# EAGLE design Card_Pi_HAT (EAGLE 6.4)
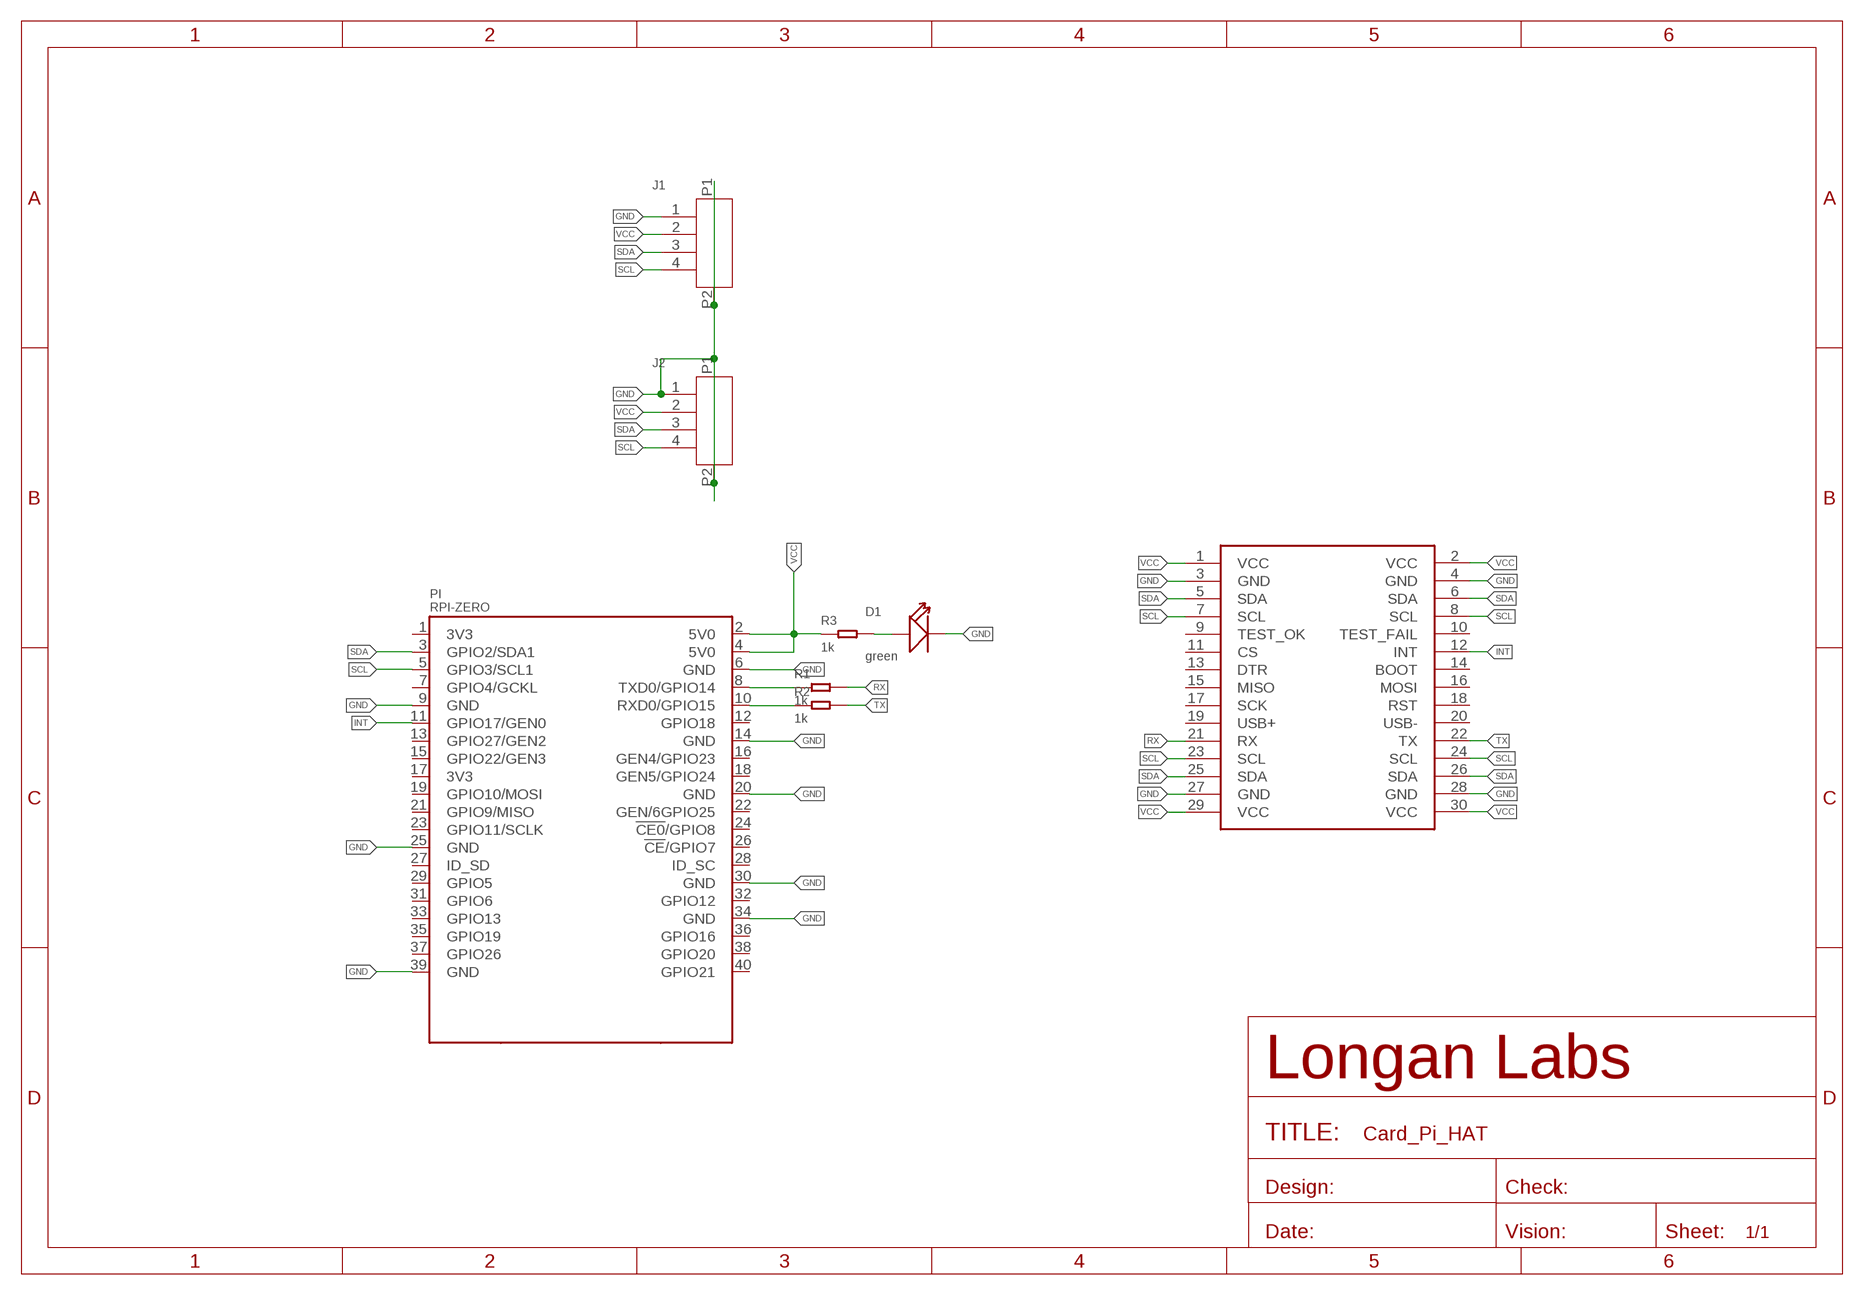
[diagram p0: schematic, sheet 1]

## Parts
D1  green  LED'0603'  [LED-0603]
J1  HEADER-4P-1.0  [4P-1.0-90D]
J2  HEADER-4P-1.0  [4P-1.0-90D]
MOUDLE1  MOUDLE-2X15P-2.54'90D'  [2X15P-2.54-90D]
PI  RPI-ZERO  [RASPBERRYPI_BASTELSTUBE_V13_RASPI_BOARD_B+_FULL]
R1  1k  RES-0603  [R0603]
R2  1k  RES-0603  [R0603]
R3  1k  RES-0603  [R0603]

## Nets
GND: D1.- J1.1 J1.P1 J1.P2 J2.1 J2.P1 J2.P2 MOUDLE1.3(GND) MOUDLE1.4(GND) MOUDLE1.27(GND) MOUDLE1.28(GND) PI.6(GND) PI.9(GND) PI.14(GND) PI.20(GND) PI.25(GND) PI.30(GND) PI.34(GND) PI.39(GND)
INT: MOUDLE1.12(INT) PI.11(GPIO17/GEN0)
N$1: PI.8(TXD0/GPIO14) R1.1
N$2: PI.10(RXD0/GPIO15) R2.1
N$3: D1.+ R3.2
RX: MOUDLE1.21(RX) R1.2
SCL: J1.4 J2.4 MOUDLE1.7(SCL) MOUDLE1.8(SCL) MOUDLE1.23(SCL) MOUDLE1.24(SCL) PI.5(GPIO3/SCL1)
SDA: J1.3 J2.3 MOUDLE1.5(SDA) MOUDLE1.6(SDA) MOUDLE1.25(SDA) MOUDLE1.26(SDA) PI.3(GPIO2/SDA1)
TX: MOUDLE1.22(TX) R2.2
VCC: J1.2 J2.2 MOUDLE1.1(VCC) MOUDLE1.2(VCC) MOUDLE1.29(VCC) MOUDLE1.30(VCC) PI.2(5V0) PI.4(5V0) R3.1
Unconnected: MOUDLE1.9(TEST_OK) MOUDLE1.10(TEST_FAIL) MOUDLE1.11(CS) MOUDLE1.13(DTR) MOUDLE1.14(BOOT) MOUDLE1.15(MISO) MOUDLE1.16(MOSI) MOUDLE1.17(SCK) MOUDLE1.18(RST) MOUDLE1.19(USB+) MOUDLE1.20(USB-) PI.1(3V3) PI.7(GPIO4/GCKL) PI.12(GPIO18) PI.13(GPIO27/GEN2) PI.15(GPIO22/GEN3) PI.16(GEN4/GPIO23) PI.17(3V3) PI.18(GEN5/GPIO24) PI.19(GPIO10/MOSI) PI.21(GPIO9/MISO) PI.22(GEN/6GPIO25) PI.23(GPIO11/SCLK) PI.24(!CE0!/GPIO8) PI.26(!CE!/GPIO7) PI.27(ID_SD) PI.28(ID_SC) PI.29(GPIO5) PI.31(GPIO6) PI.32(GPIO12) PI.33(GPIO13) PI.35(GPIO19) PI.36(GPIO16) PI.37(GPIO26) PI.38(GPIO20) PI.40(GPIO21)

## Library data of the parts
D1 = Discrete-new:LED
J1 J2 = Longan-Connect:HEADER-4P-1.0
MOUDLE1 = Longan-moudle:MOUDLE-2X15P-2.54
PI = RPI-Zero:RPI-ZERO
R1-R3 = Discrete-new:RES

## Board
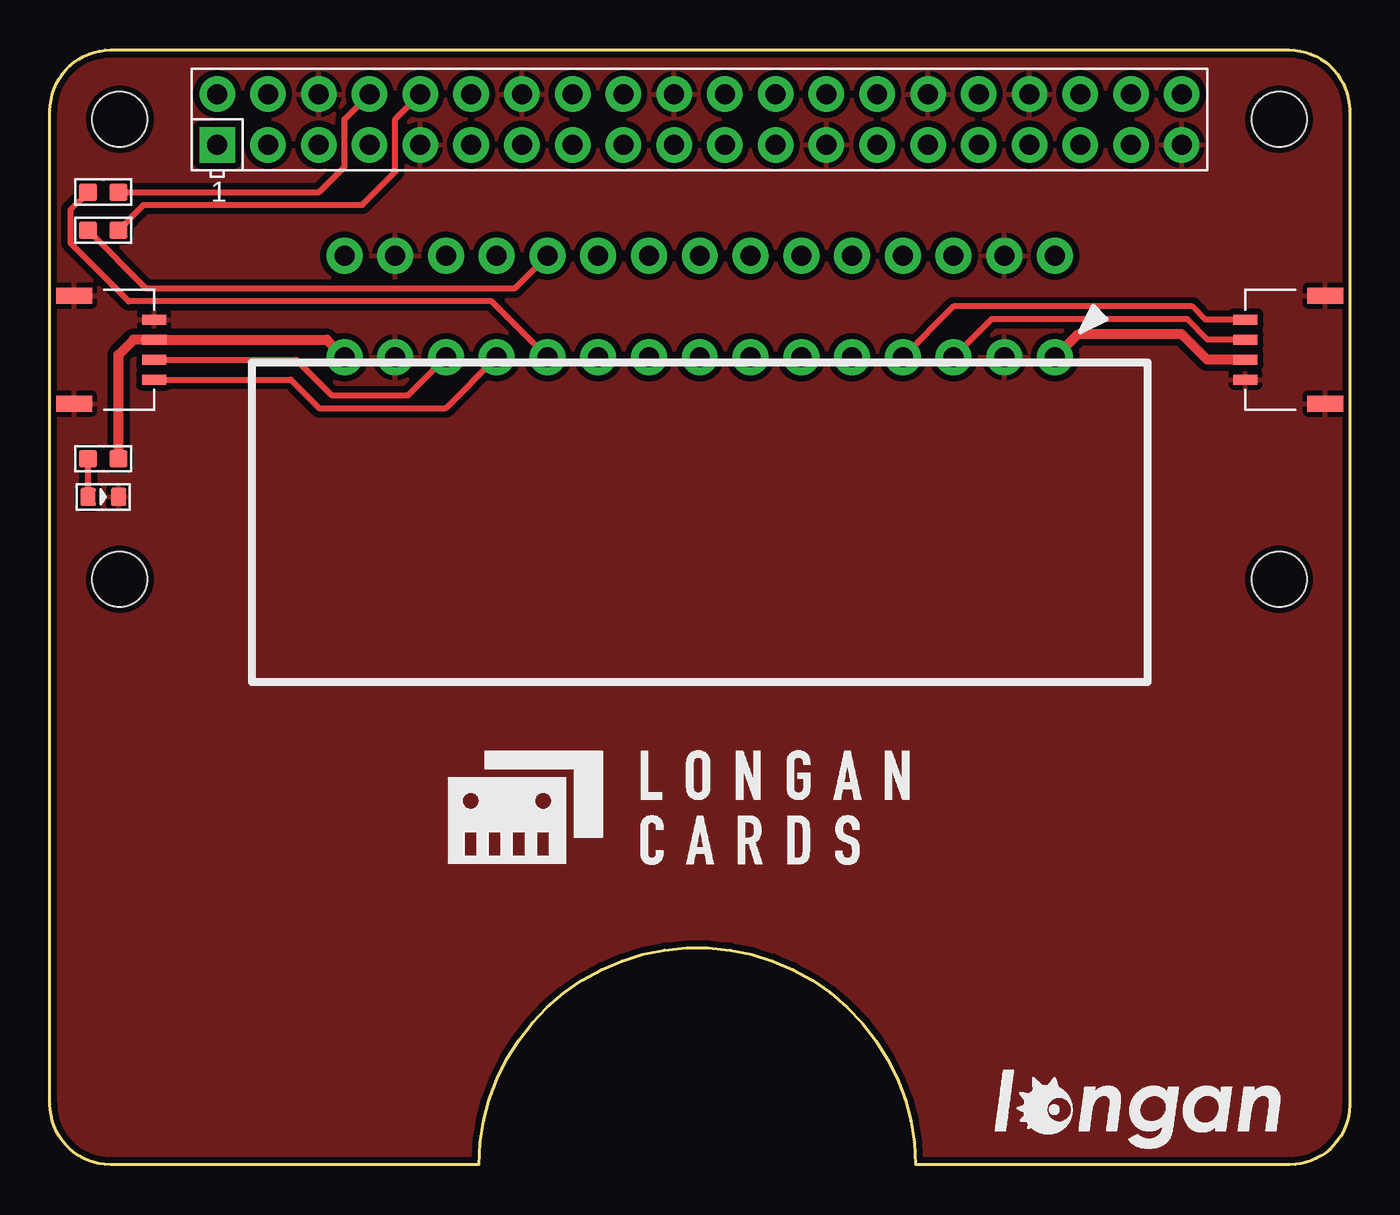
[diagram p1: board, top side]
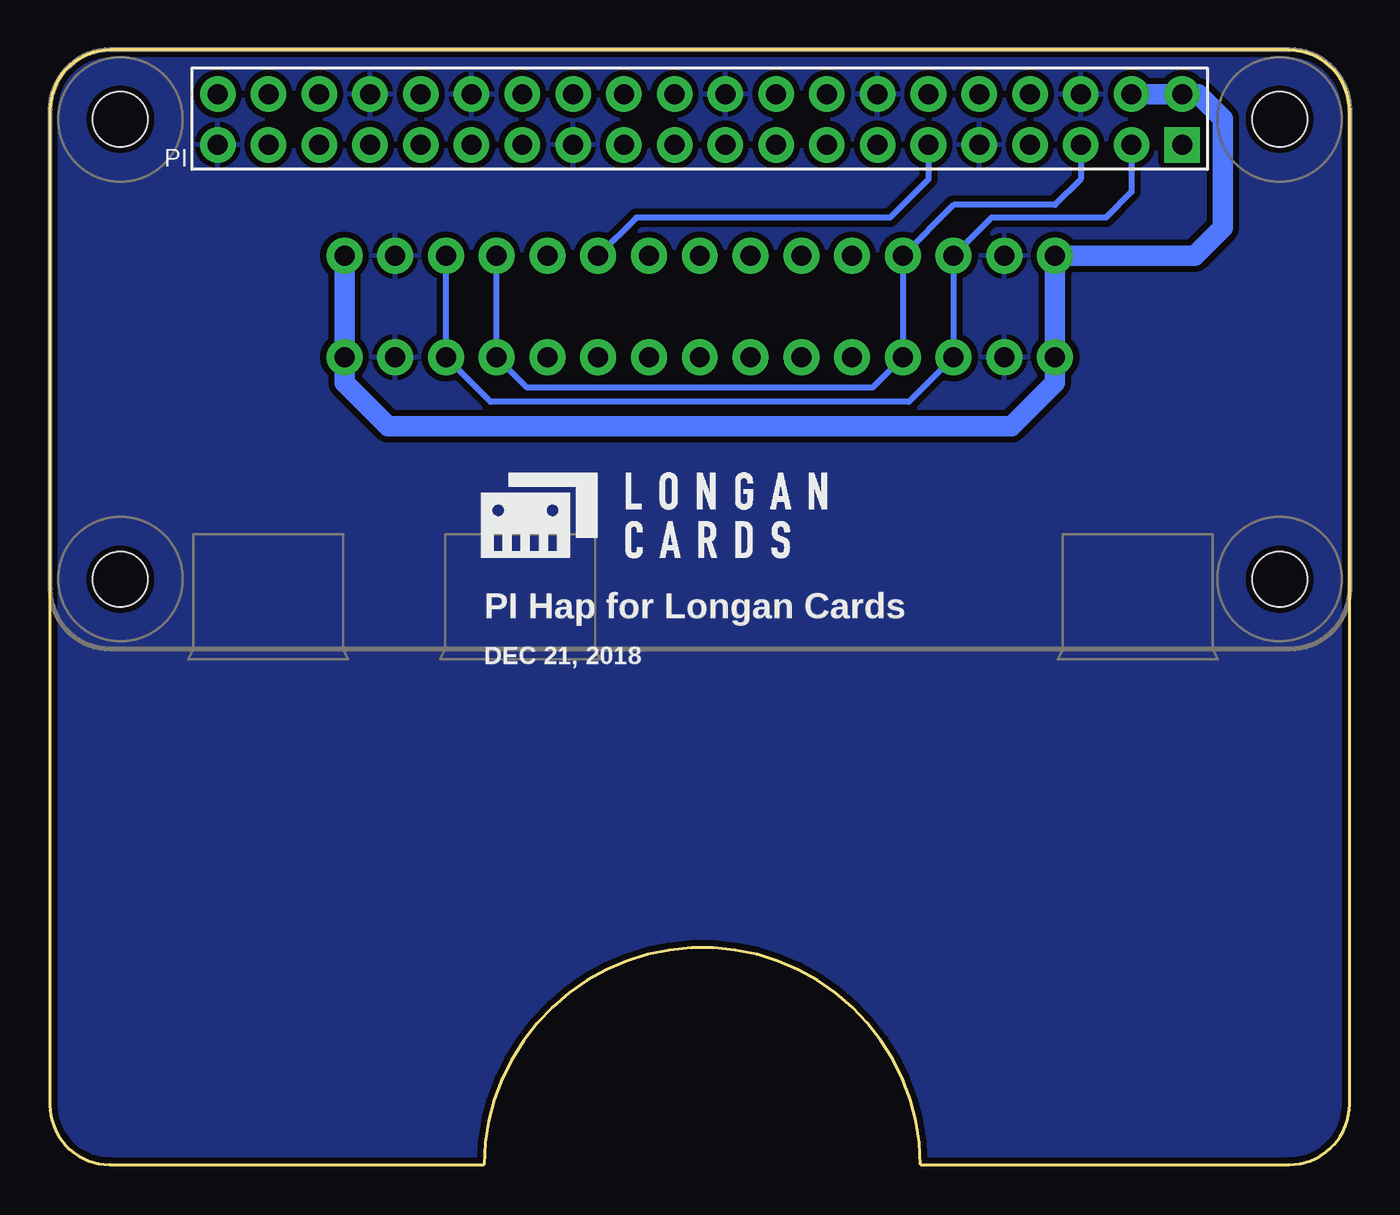
[diagram p2: board, bottom side, seen from below]

Size 65.02 x 55.75 mm. Coordinates in mm from the lower left corner, seen from the top.
Outline: 3.04,55.75 62,55.75 arc-90 65.02,52.73 65.02,2.98 arc-90 62.04,0 43.31,0 arc179 21.46,0 3.02,0 arc-90 0,3.02 0,52.72 arc-90 3.04,55.75
Copper layers (1*16): Top 0.035mm / dielectric 1.5mm / Bottom 0.035mm
Design rules "SeeedStudio_2layer_DRU_no_angle_20140221 *": minimum track width 6mil, minimum drill 10mil, track to track 6mil, track to pad 6mil, pad to pad 6mil, via to via 6mil, smd to smd 0mil, copper to edge 10mil, drill to drill 10mil, minimum pad ring 10mil, minimum via ring 6mil, stop-mask expansion 2mil, vias tented up to drill 25mil, thermal gap 10mil
tRestrict: area -24.4,55.7 to -20.4,59.7; area -24.4,32.6 to -20.4,36.6; area -82.3,32.6 to -78.3,36.6
bRestrict: area -24.4,55.7 to -20.4,59.7; area -24.4,32.6 to -20.4,36.6; area -82.3,32.6 to -78.3,36.6

### Footprints (pad centres in the part's own frame; a part is rotated, then mirrored left to right if it is on the bottom)
LED-0603 = smd 0.762 x 0.889: + -0.762,0; - 0.762,0
4P-1.0-90D = smd 1.2 x 0.5: 1 0,1.5; 2 0,0.5; 3 0,-0.5; 4 0,-1.5 | smd 1.8 x 0.8: P1 -4,2.7; P2 -4,-2.7
2X15P-2.54-90D = drill 1 pad 1.8: 1 -17.78,-8.255; 2 -17.78,-13.335; 3 -15.24,-8.255; 4 -15.24,-13.335; 5 -12.7,-8.255; 6 -12.7,-13.335; 7 -10.16,-8.255; 8 -10.16,-13.335; 9 -7.62,-8.255; 10 -7.62,-13.335; 11 -5.08,-8.255; 12 -5.08,-13.335; 13 -2.54,-8.255; 14 -2.54,-13.335; 15 0,-8.255; 16 0,-13.335; 17 2.54,-8.255; 18 2.54,-13.335; 19 5.08,-8.255; 20 5.08,-13.335; 21 7.62,-8.255; 22 7.62,-13.335; 23 10.16,-8.255; 24 10.16,-13.335; 25 12.7,-8.255; 26 12.7,-13.335; 27 15.24,-8.255; 28 15.24,-13.335; 29 17.78,-8.255; 30 17.78,-13.335
RASPBERRYPI_BASTELSTUBE_V13_RASPI_BOARD_B+_FULL = drill 1 pad 1.778 square: 1 8.37,25.23 | drill 1 pad 1.778: 2 8.37,27.77; 3 10.91,25.23; 4 10.91,27.77; 5 13.45,25.23; 6 13.45,27.77; 7 15.99,25.23; 8 15.99,27.77; 9 18.53,25.23; 10 18.53,27.77; 11 21.07,25.23; 12 21.07,27.77; 13 23.61,25.23; 14 23.61,27.77; 15 26.15,25.23; 16 26.15,27.77; 17 28.69,25.23; 18 28.69,27.77; 19 31.23,25.23; 20 31.23,27.77; 21 33.77,25.23; 22 33.77,27.77; 23 36.31,25.23; 24 36.31,27.77; 25 38.85,25.23; 26 38.85,27.77; 27 41.39,25.23; 28 41.39,27.77; 29 43.93,25.23; 30 43.93,27.77; 31 46.47,25.23; 32 46.47,27.77; 33 49.01,25.23; 34 49.01,27.77; 35 51.55,25.23; 36 51.55,27.77; 37 54.09,25.23; 38 54.09,27.77; 39 56.63,25.23; 40 56.63,27.77 | hole 2.75: 3.5,3.5; 3.5,26.5; 61.5,3.5; 61.5,26.5
R0603 = smd 0.889 x 0.889: 1 0,0.762; 2 0,-0.762

### Placement (x,y rotation side)
D1  2.67,33.4 0 top
J1  5.21,40.77 0 top
J2  59.82,40.77 180 top
MOUDLE1  32.51,32.13 180 top
PI  0,25.78 0 top
R1  2.67,48.64 270 top
R2  2.67,46.74 270 top
R3  2.67,35.31 270 top
U$2  [LONGAN-CARDS-BIG]  18.92,14.35 0 top
U$3  [LONGAN-SILK-SMALLER]  45.97,-0.38 0 top
U$4  [LONGAN-CARDS-MIDDLE]  44.2,29.84 0 bottom

### Tracks (layer width: path | path; a pad name or v marks a point on that pad's centre or on a via)
GND
  pour Top (isolate 0.305): 0,55.75 65.15,56.26 65.15,-0.51 0.13,-0.51
  pour Bottom (isolate 0.305): 0,55.75 65.02,55.75 65.02,-1.02 0,-1.02
INT
  Bottom 0.305: PI.11 21.07,49.29 22.99,47.37 35.69,47.37 MOUDLE1.12
N$1
  Top 0.305: R1.1 13.46,48.64 14.73,49.91 14.73,52.29 PI.8
N$2
  Top 0.305: R2.1 4.7,48.01 15.62,48.01 17.27,49.66 17.27,52.29 PI.10
N$3
  Top 0.305: D1.+ R3.2
RX
  Top 0.305: R1.2 1.02,47.75 1.02,46.1 3.94,43.18 22.1,43.18 MOUDLE1.21
SCL
  Top 0.305: J2.4 57.81,42.27 57.15,42.93 45.21,42.93 MOUDLE1.7 | J1.4 12.04,39.27 13.46,37.85 19.81,37.85 MOUDLE1.23
  Bottom 0.305: MOUDLE1.8 MOUDLE1.7 41.15,38.86 23.88,38.86 MOUDLE1.23 MOUDLE1.24 19.81,48.01 14.73,48.01 13.45,49.29 PI.5
SDA
  Top 0.305: J2.3 57.92,41.27 56.9,42.29 47.12,42.29 MOUDLE1.5 | J1.3 12.31,40.27 14.1,38.48 17.91,38.48 MOUDLE1.25
  Bottom 0.305: MOUDLE1.6 MOUDLE1.5 42.97,38.15 22.05,38.15 MOUDLE1.25 MOUDLE1.26 17.91,47.37 12.19,47.37 10.91,48.65 PI.3
TX
  Top 0.305: MOUDLE1.22 23.24,43.81 4.83,43.81 R2.2
VCC
  Top 0.508: R3.1 3.43,40.51 4.18,41.27 J1.2 13.85,41.27 MOUDLE1.29 | J2.2 57.9,40.27 56.64,41.53 51.44,41.53 MOUDLE1.1
  Bottom 1.016: PI.4 PI.2 7.58,53.55 6.35,52.32 6.35,46.86 7.75,45.47 MOUDLE1.30 MOUDLE1.29 14.73,39.12 16.93,36.92 48.1,36.92 50.29,39.12 MOUDLE1.1 MOUDLE1.2

### Text on the board
bPlace: PI | PI Hap for Longan Cards | DEC 21, 2018